# Altium project DTM17E0000.PrjPcb
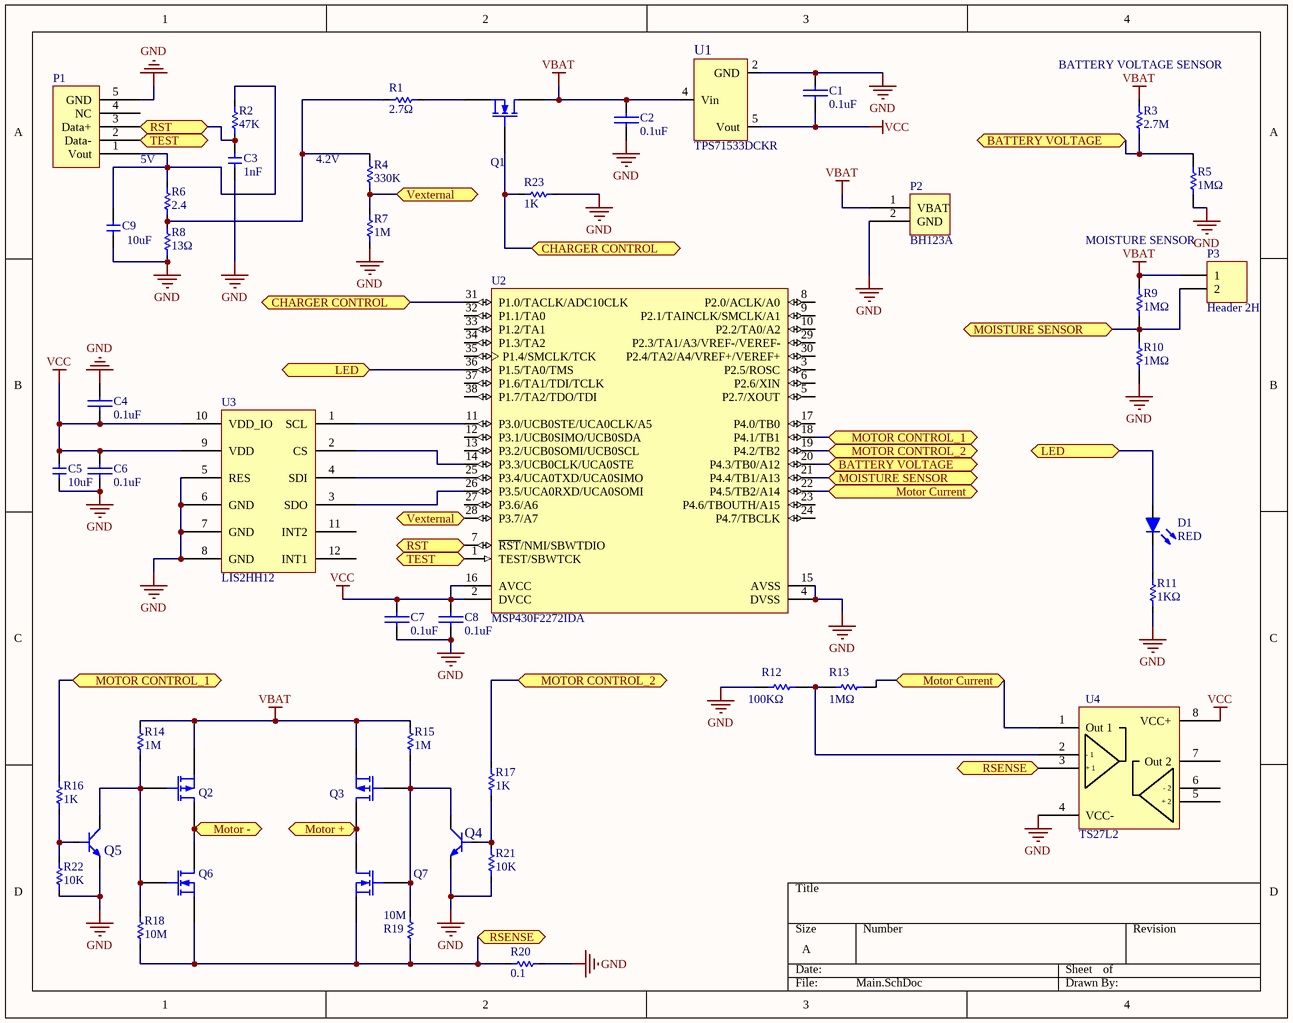
[diagram p0: Main.SchDoc]
1 sheet, 47 parts. Net scope: flat (ports and power ports of the same name join across sheets).
Board file: DTM17E0000.PcbDoc

## Sheet Main.SchDoc
size A

### Parts
C1  0.1uF  [0603 Small]
C2  0.1uF  [0603 Small]
C3  1nF  [0402 Small]
C4  0.1uF  [0603 Small]
C5  10uF  [0805 Small]
C6  0.1uF  [0603 Small]
C7  0.1uF  [0603 Small]
C8  0.1uF  [0603 Small]
C9  10uF  [0805 Small]
D1  RED  [0603 LED]
P1  Mini USB  [Mini USB]  (value not drawn)
P2  BH123A  [BH123A - duplicate]
P3  Header 2H  [Header 2]
Q1  MOSFET-N  [SOT23]  (value not drawn)
Q2  MOSFET-P  [SOT23]  (value not drawn)
Q3  MOSFET-P  [SOT23]  (value not drawn)
Q4  MMST2222A  [SOT-23N]  (value not drawn)
Q5  MMST2222A  [SOT-23N]  (value not drawn)
Q6  MOSFET-N  [SOT23]  (value not drawn)
Q7  MOSFET-N  [SOT23]  (value not drawn)
R1  2.7Ω  [2010 resistor]
R2  47K  [0402 Resistor]
R3  2.7M  [0402 Small]
R4  330K  [0402 Resistor]
R5  1MΩ  [0603 Resistor]
R6  2.4  [0805 Small]
R7  1M  [0603 resistor]
R8  13Ω  [2512 RESISTOR]
R9  1MΩ  [0603 Resistor]
R10  1MΩ  [0603 Resistor]
R11  1KΩ  [0402 Resistor]
R12  100KΩ  [0603 Resistor]
R13  1MΩ  [0603 Resistor]
R14  1M  [0603 resistor]
R15  1M  [0603 resistor]
R16  1K  [0603 resistor]
R17  1K  [0603 resistor]
R18  10M  [0603 resistor]
R19  10M  [0603 resistor]
R20  0.1  [2512 RESISTOR]
R21  10K  [0402 Resistor]
R22  10K  [0402 Resistor]
R23  1K  [0603 resistor]
U1  TPS71533DCKR  [SC70_5]
U2  MSP430F2272IDA  [MSP430F2272IDA]
U3  LIS2HH12  [LIS2HH12]
U4  TS27L2  [SOIC-8]

### Ports
BATTERY VOLTAGE, CHARGER CONTROL, LED, MOISTURE SENSOR, Motor +, Motor -, MOTOR CONTROL_1, MOTOR CONTROL_2, Motor Current, RSENSE, RST, TEST, Vexternal

### Nets
GND: C1.1 C2.2 C3.1 C4.1 C5.1 C6.2 C7.2 C8.2 C9.1 P1.5(GND) P2.2(GND) Q4.E Q5.E R5.1 R7.2 R8.1 R10.1 R11.1 R12.1 R20.1 R21.2 R22.2 R23.2 U1.2(GND) U2.4(DVSS) U2.15(AVSS) U3.5(RES) U3.6(GND) U3.7(GND) U3.8(GND) U4.4(VCC-)
VBAT: C2.1 P2.1(VBAT) P3.1 Q1.3(D) Q2.2(S) Q3.2(S) R3.1 R9.2 R14.1 R15.1 U1.4(Vin)
VCC: C1.2 C4.2 C5.2 C6.1 C7.1 C8.1 U1.5(Vout) U2.2(DVCC) U2.16(AVCC) U3.9(VDD) U3.10(VDD_IO) U4.8(VCC+)
NetC3_2: C3.2 P1.3(Data+) R2.2 U2.7(~{RST}/NMI/SBWTDIO) ; port RST
NetC9_2: C9.2 P1.1(Vout) R2.1 R6.2
NetD1_1: D1.1(A) U2.36(P1.5/TA0/TMS) ; port LED
NetD1_2: D1.2(K) R11.2
NetP1_2: P1.2(Data-) U2.1(TEST/SBWTCK) ; port TEST
NetP3_2: P3.2 R9.1 R10.2 U2.21(P4.4/TB1/A13) ; port MOISTURE SENSOR
NetQ1_1: Q1.1(G) R23.1 U2.31(P1.0/TACLK/ADC10CLK) ; port CHARGER CONTROL
NetQ1_2: Q1.2(S) R1.1
NetQ2_1: Q2.1(G) Q5.C Q6.1(G) R14.2 R18.2
NetQ2_3: Q2.3(D) Q6.3(D) ; port Motor -
NetQ3_1: Q3.1(G) Q4.C Q7.1(G) R15.2 R19.2
NetQ3_3: Q3.3(D) Q7.3(D) ; port Motor +
NetQ4_B: Q4.B R17.2 R21.1
NetQ5_B: Q5.B R16.1 R22.1
NetQ6_2: Q6.2(S) Q7.2(S) R18.1 R19.1 R20.2 U4.3(+_1) ; port RSENSE
NetR1_2: R1.2 R4.1 R6.1 R8.2
NetR3_2: R3.2 R5.2 U2.20(P4.3/TB0/A12) ; port BATTERY VOLTAGE
NetR4_2: R4.2 R7.1 U2.28(P3.7/A7) ; port Vexternal
NetR12_2: R12.2 R13.2 U4.2(-_1)
NetR13_1: R13.1 U2.22(P4.5/TB2/A14) U4.1(Out_1) ; port Motor Current
NetR16_2: R16.2 U2.18(P4.1/TB1) ; port MOTOR CONTROL_1
NetR17_1: R17.1 U2.19(P4.2/TB2) ; port MOTOR CONTROL_2
NetU2_11: U2.11(P3.0/UCB0STE/UCA0CLK/A5) U3.1(SCL)
NetU2_14: U2.14(P3.3/UCB0CLK/UCA0STE) U3.2(CS)
NetU2_25: U2.25(P3.4/UCA0TXD/UCA0SIMO) U3.4(SDI)
NetU2_26: U2.26(P3.5/UCA0RXD/UCA0SOMI) U3.3(SDO)

Not connected (* = marked no-connect by the designer): P1 4(NC); U2 3(P2.5/ROSC) 5(P2.7/XOUT) 6(P2.6/XIN) 8(P2.0/ACLK/A0) 9(P2.1/TAINCLK/SMCLK/A1) 10(P2.2/TA0/A2) 12(P3.1/UCB0SIMO/UCB0SDA) 13(P3.2/UCB0SOMI/UCB0SCL) 17(P4.0/TB0) 23(P4.6/TBOUTH/A15) 24(P4.7/TBCLK) 27(P3.6/A6) 29(P2.3/TA1/A3/VREF-/VEREF-) 30(P2.4/TA2/A4/VREF+/VEREF+) 32(P1.1/TA0) 33(P1.2/TA1) 34(P1.3/TA2) 35(P1.4/SMCLK/TCK) 37(P1.6/TA1/TDI/TCLK) 38(P1.7/TA2/TDO/TDI); U3 11(INT2) 12(INT1); U4 5(+_2) 6(-_2) 7(Out_2)

### Notes on the sheet
- (near R3) BATTERY VOLTAGE SENSOR
- 5V
- (near R4) 4.2V
- MOISTURE SENSOR

### Library data of the parts
C1 C2 C4 C6-C8 = CAP: CAP CER 0.1UF 50V 10% X7R 0603; Manufacturer#: GRM188R71H104KA93J; Manufacturer: Murata Electronics; Cost: 0.022
C3 = Cap: CAP CER 1000PF 6.3V X5R 0402; Manufacturer: Murata Electronics; Manufacturer#: GRM155R60J102KA01D; Cost: .0024
C5 C9 = Cap: CAP CER 10UF 6.3V X5R 0805; Manufacturer: Samsung Electro-Mechanical; Manufacturer#: CL21A106KQCLRNC; Cost: .01526
D1 = LED2: Standard LEDs - SMD Red 630nm 700mcd; Manufacturer: Kingbright; Manufacturer#: APTD1608SURCK; Cost: 0.098
P1 = Mini USB: CONN MINI USB RCPT RA TYPE B SMD; Manufacturer: EDAC Inc.; Manufacturer#: 690-005-299-043; Cost: 0.2805
P3 = Header 2H: Header, 2-Pin, Right Angle; LatestRevisionDate: 17-Jul-2002; LatestRevisionNote: Re-released for DXP Platform.; Publisher: Altium Limited
Q1 Q6 Q7 = MOSFET-N: N-Channel MOSFET; Manufacturer: Infineon Technologies; Manufacturer#: BSS806N H6327; Cost: 0.07392
Q2 Q3 = MOSFET-P: MOSFET P-CH 20V 4.2A SOT23; Manufacturer: Diodes Incorporated; Mandufacturer#: DMG2305UX-13; Cost: 0.0738
Q4 Q5 = NPN1: TRANSISTOR NPN GP 40V SOT23; Manufacturer: MICRO COMMERCIAL CO; Manufacturer#: MMBT2222A-TP; Cost: 0.0278
R1 = Resistor: RES SMD 2.7 OHM 5% 3/4W 2010; Manufacturer: Panasonic Electronic Components; Manufacturer#: ERJ-12ZYJ2R7U; Cost: 0.03544
R2 = Resistor: RES SMD 47K OHM 5% 1/16W 0402; Manufacturer: Samsung Electro-Mechanics; Manufacturer#: RC1005J473CS; Cost: .00188
R3 = Resistor: RES SMD 2.7M OHM 5% 1/16W 0402; Manufacturer: Yageo; Manufacturer#: RC0402JR-072M7L; Cost: 0.00172
R4 = Resistor: RES SMD 330K OHM 5% 1/10W 0603; Manufacturer: Yageo; Manufacturer#: RC0603JR-07330KL; Cost: 0.0018
R5 R9 R10 R13 = Res1: RES SMD 1M OHM 5% 1/10W 0603; Manufacturer: Yageo; Manufacturer#: RC0603JR-071ML; Cost: .00198
R6 = Resistor: RES SMD 2 OHM 5% 0.4W 0805; Manufacturer: Rohm Semiconductor; Manufacturer#: ESR10EZPJ2R4; Cost: 0.01331
R7 R14 R15 = Resistor: RES SMD 1M OHM 5% 1/10W 0603; Manufacturer: Yageo; Manufacturer#: RC0603JR-071ML
  R7: Cost: 0.00180
  R14 R15: Cost: 0.0018
R8 = Resistor: RES SMD 13 OHM 1% 2W 2512; Manufacturer: TE Connectivity Passive Product; Manufacturer#: 352113RFT; Cost: 0.12187
R11 = Resistor: RES 10K OHM .25W 5% 0603 SMD; Manufacturer: TE Connectivity Passive Product; Manufacturer#: CRG0402J1K0; Cost: 0.00175
R12 = Res1: RES SMD 100K OHM 5% 1/10W 0603; Manufacturer: Yageo; Manufacturer#: RC0603JR-07100KL; Cost: 0.00198
R16 R17 R23 = Resistor: RES SMD 1K OHM 5% 1/10W 060; Manufacturer: Yageo; Manufacturer#: RC0603JR-071KL; Cost: 0.0018
R18 R19 = Resistor: RES SMD 10M OHM 5% 1/10W 0603; Manufacturer: Yageo; Manufacturer#: RC0603JR-0710ML; Cost: 0.0018
R20 = Resistor: RES SMD 0.1 OHM 5% 2W 2512; Manufacturer: Bourns Inc.; Manufacturer#: CRM2512-JX-R100ELF; Cost: .10395
R21 R22 = Resistor: RES SMD 10K OHM 5% 1/16W 0402; Manufacturer: TE Connectivity Passive Product; Manufacturer#: CRG0402J10K/10; Cost: 0.00167
U1 = TPS71533DCKR: IC REG LDO 3.3V 50MA SC70-5; Manufacturer: Texas Instruments; Cost: 0.3952; Manufacturer#: TPS71533DCKR
U2 = CMP-0365-00081-2: 16 MHz Mixed Signal Microcontroller with 32 KB Flash, 1024 B SARM and 32 GPIOs, -40 to 85 degC, 38-pin SOP (DA), Green (RoHS & no Sb/Br); Manufacturer: Texas Instruments; Brown Out Reset: Yes; USCI_A (UART/LIN/IrDA/SPI): 1; ADC Channels: 12; SRAM(B): 1024; Frequency(MHz): 16; GPIO: 32; SubFamily: 2 Series, Extended Temp; Timers - 16-bit: 2; ADC: 10-bit SAR; ComponentLink2Description: Datasheet; PartNumber: MSP430F2272IDA; ComponentLink2URL: http://www.ti.com/general/docs/lit/getliterature.tsp?genericPartNumber=MSP430F2272&fileType=pdf; ComponentLink1URL: http://www.ti.com/; ComponentLink3Description: Package Specification; ComponentLink1Description: Manufacturer URL; ComponentLink3URL: http://www.ti.com/lit/ml/mtss002e/mtss002e.pdf; DatasheetVersion: SLAS504G; Code_JEDEC: MO-153; Eco-Plan: Green (RoHS & no Sb/Br); USCI_B (I2C & SPI): 1; PackageDescription: 38-Pin Plastic Small-Outline Package, Body 6.10 x 12.50 mm, Pitch 0.65 mm; Flash(KB): 32; Mounting Technology: Surface Mount; Watchdog: Yes; PackageReference: DA0038A; PackageVersion: 4040066/F
U3 = LIS2HH12: Manufacturer: STMicro; Manufacturer#: LIS2HH12; Cost: .486
U4 = TS27L2: OP AMP - 2 CHANNEL; Manufacturer: STMicroelectronics; Manufacturer#: TS27L2CDT; Cost: .1842